# Altium schematic sheet System Control - Bank0.SchDoc
size C
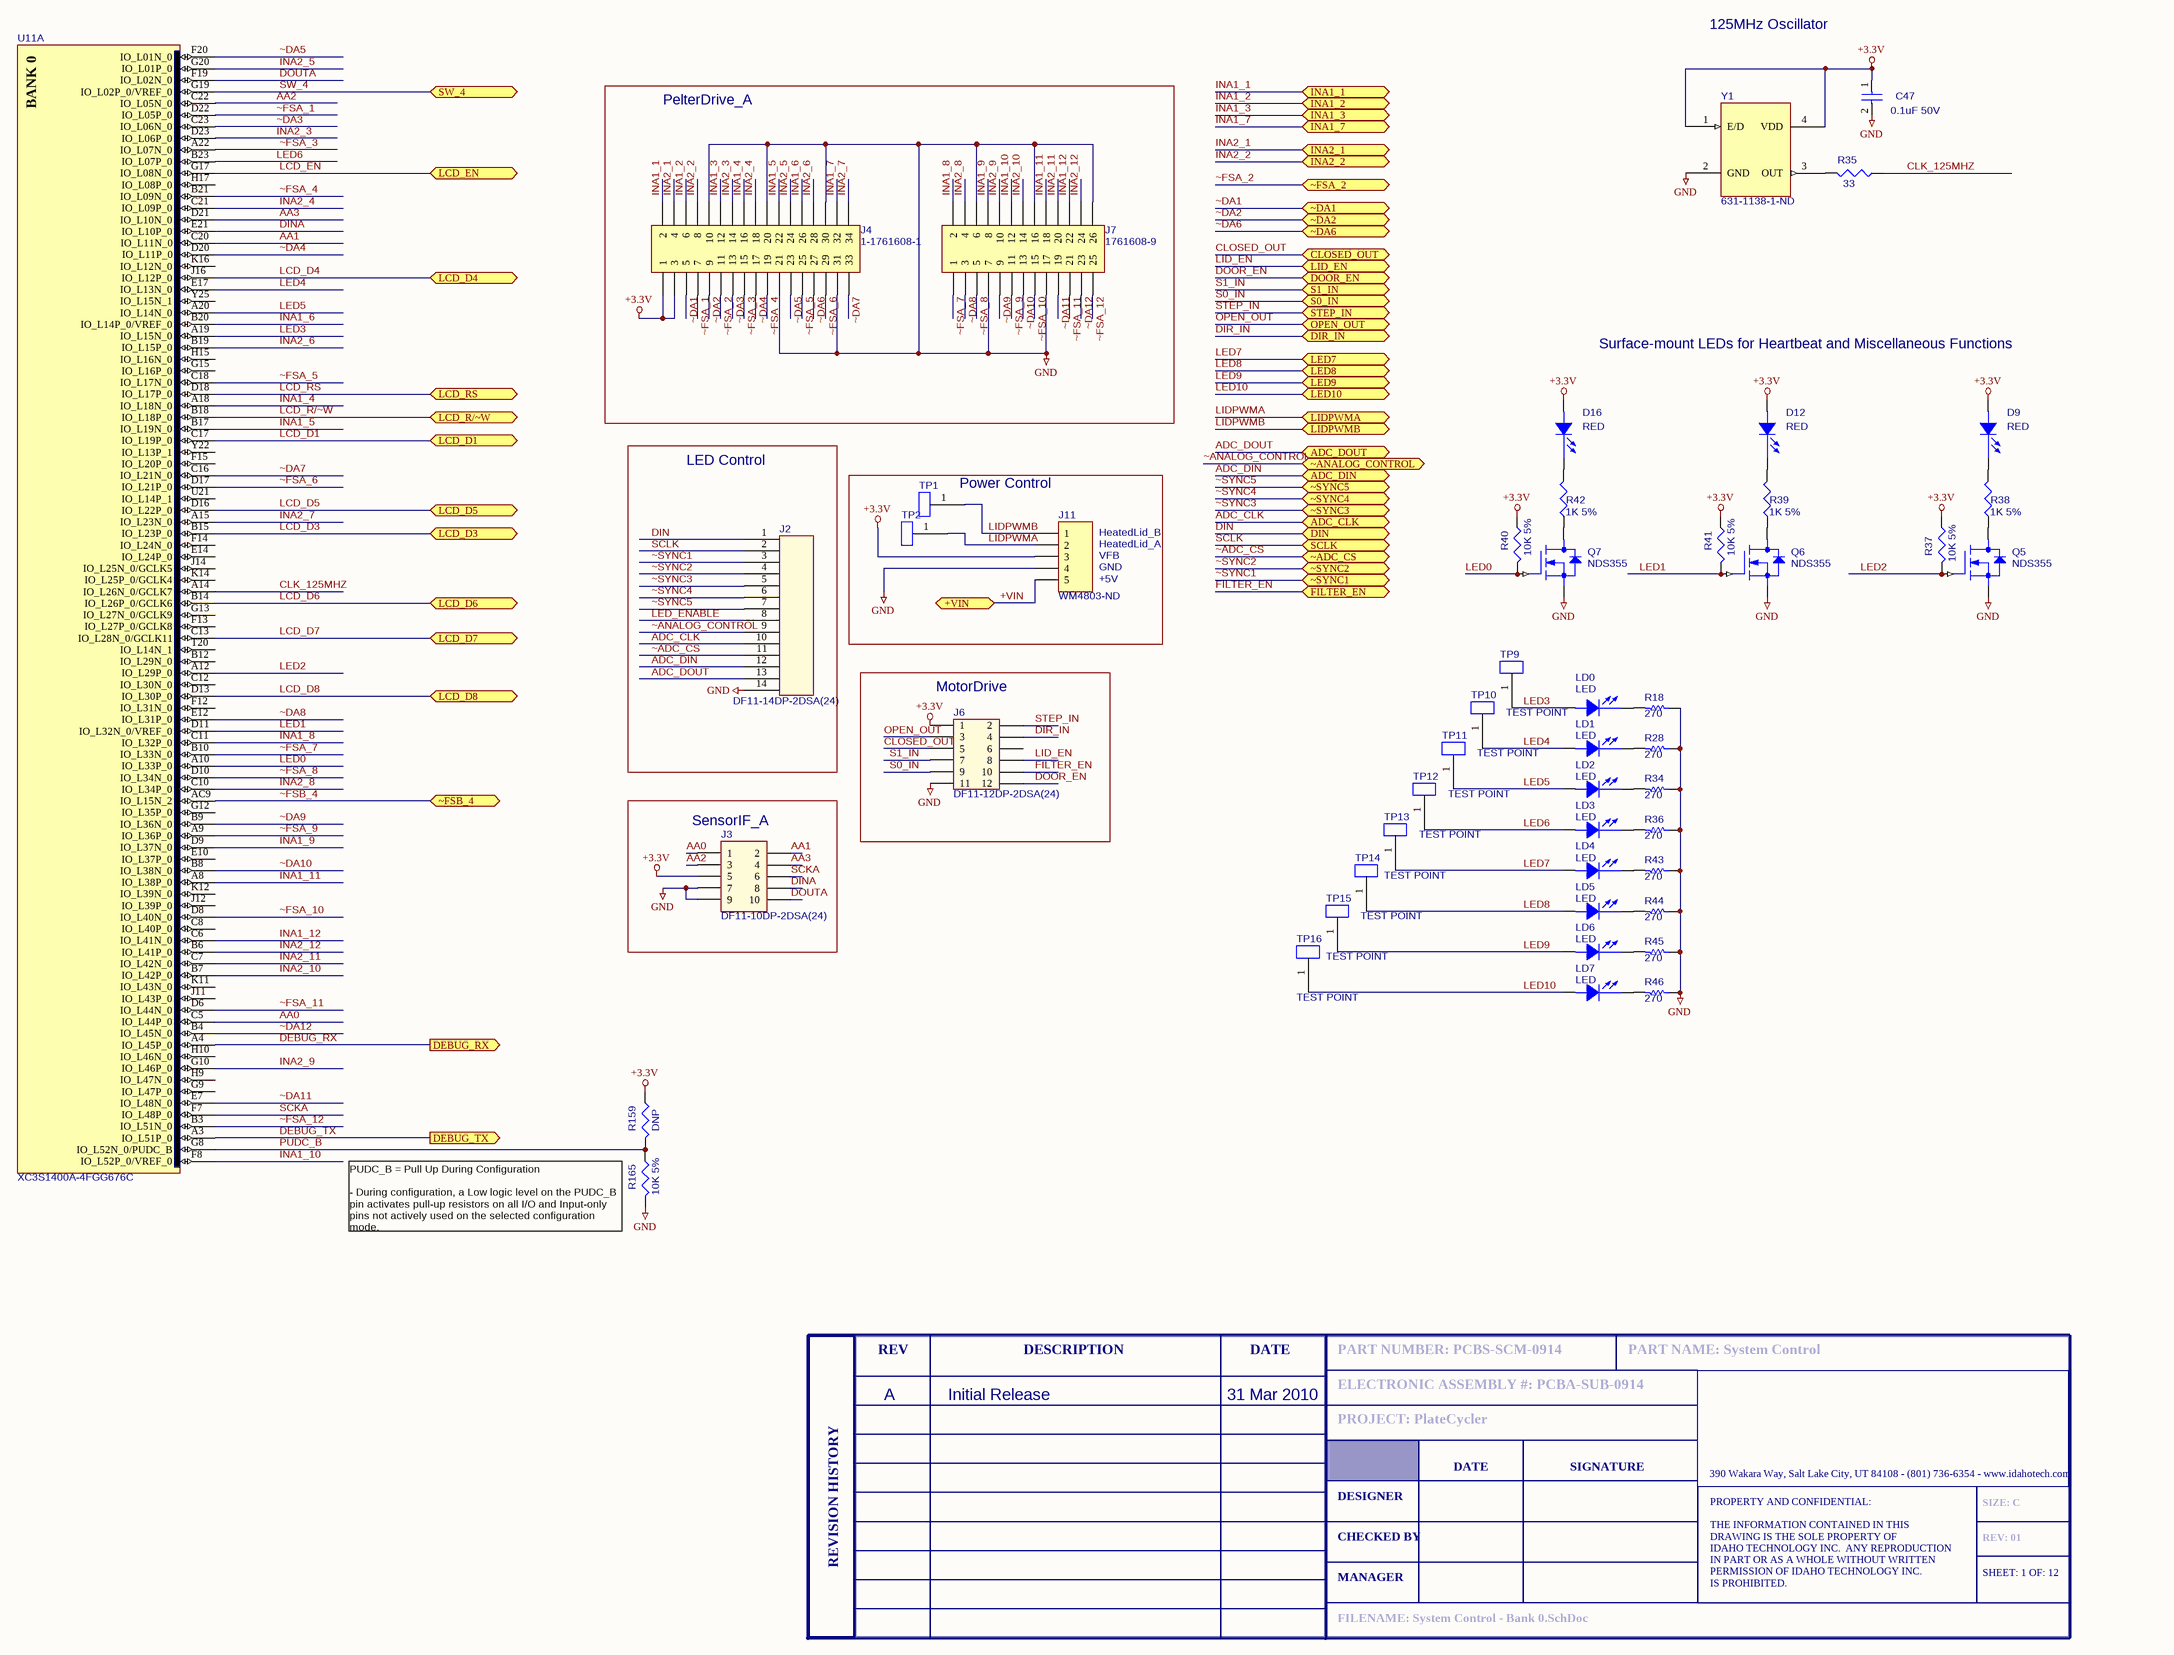
[diagram p0: System Control - Bank0.SchDoc]

## Parts
C47  0.1uF 50V  [SM/C_0603]
D9  RED  [LED 1206]
D12  RED  [LED 1206]
D16  RED  [LED 1206]
J2  Manufacturer P/N: DF11-14DP-2DSA(24)  [HEADER_2X7_1]  (hidden comment: LED Driver)
J3  Manufacturer P/N: DF11-10DP-2DSA(24)  [HEADER_2X5_1]  (hidden comment: Sensor I/F A)
J4  Manufacturer P/N: 1-1761608-1  [HEADER_2X17_2]
J6  Manufacturer P/N: DF11-12DP-2DSA(24)  [HEADER_2X6_1]  (hidden comment: Motor Drive)
J7  Manufacturer P/N: 1761608-9  [HEADER_2X13_2]
J11  Vendor P/N: WM4803-ND  [HDR1X5]  (hidden comment: PWR CONTROL)
LD0  LED  [SM/D_0603]
LD1  LED  [SM/D_0603]
LD2  LED  [SM/D_0603]
LD3  LED  [SM/D_0603]
LD4  LED  [SM/D_0603]
LD5  LED  [SM/D_0603]
LD6  LED  [SM/D_0603]
LD7  LED  [SM/D_0603]
Q5  NDS355  [TO236AA/SOT23]
Q6  NDS355  [TO236AA/SOT23]
Q7  NDS355  [TO236AA/SOT23]
R18  value 270  [0603]  (hidden comment: Res1)
R28  value 270  [0603]  (hidden comment: Res1)
R34  value 270  [0603]  (hidden comment: Res1)
R35  33  [SM/R_0603]
R36  value 270  [0603]  (hidden comment: Res1)
R37  10K 5%  [SM/R_0603]
R38  1K 5%  [SM/R_0603]
R39  1K 5%  [SM/R_0603]
R40  10K 5%  [SM/R_0603]
R41  10K 5%  [SM/R_0603]
R42  1K 5%  [SM/R_0603]
R43  value 270  [0603]  (hidden comment: Res1)
R44  value 270  [0603]  (hidden comment: Res1)
R45  value 270  [0603]  (hidden comment: Res1)
R46  value 270  [0603]  (hidden comment: Res1)
R159  DNP  [SM/R_0603]  (no BOM)
R165  10K 5%  [SM/R_0603]
T?  SIZE: C  REV: 01  FILENAME: System Control - Bank 0.SchDoc  PART NUMBER: PCBS-SCM-0914  PART NAME: System Control  ELECTRONIC ASSEMBLY #: PCBA-SUB-0914  PROJECT: PlateCycler  SHEET: 1  OF: 12  (hidden comment: ITI Title Block)  (graphical)
TP1  LID B PWM  [BLKCON.100/VH/TM1SQ/W.100/1]  (value not drawn)
TP2  LID A PWM  [BLKCON.100/VH/TM1SQ/W.100/1]  (value not drawn)
TP9  TEST POINT  [BLKCON.100/VH/TM1SQ/W.100/1]
TP10  TEST POINT  [BLKCON.100/VH/TM1SQ/W.100/1]
TP11  TEST POINT  [BLKCON.100/VH/TM1SQ/W.100/1]
TP12  TEST POINT  [BLKCON.100/VH/TM1SQ/W.100/1]
TP13  TEST POINT  [BLKCON.100/VH/TM1SQ/W.100/1]
TP14  TEST POINT  [BLKCON.100/VH/TM1SQ/W.100/1]
TP15  TEST POINT  [BLKCON.100/VH/TM1SQ/W.100/1]
TP16  TEST POINT  [BLKCON.100/VH/TM1SQ/W.100/1]
U11  XC3S1400A-4FGG676C  [FGG676]  (part A of 9)
Y1  Vendor P/N: 631-1138-1-ND  [FXO_HC73]  (hidden comment: 125 MHz)

## Blocks framed on the sheet
PelterDrive_A: J4 J7
LED Control: J2
Power Control: J11 TP1 TP2
MotorDrive: J6
SensorIF_A: J3

## Ports
+VIN, ADC_CLK, ADC_DIN, ADC_DOUT, CLOSED_OUT, DEBUG_RX, DEBUG_TX, DIN, DIR_IN, DOOR_EN, FILTER_EN, INA1_1, INA1_2, INA1_3, INA1_7, INA2_1, INA2_2, LCD_D1, LCD_D3, LCD_D4, LCD_D5, LCD_D6, LCD_D7, LCD_D8, LCD_EN, LCD_R/~W, LCD_RS, LED7, LED8, LED9, LED10, LID_EN, LIDPWMA, LIDPWMB, OPEN_OUT, S0_IN, S1_IN, SCLK, STEP_IN, SW_4, ~ADC_CS, ~ANALOG_CONTROL, ~DA1, ~DA2, ~DA6, ~FSA_2, ~FSB_4 (bidir), ~SYNC1, ~SYNC2, ~SYNC3, ~SYNC4, ~SYNC5

## Nets
+3.3V: C47.1 D9.1(ANODE) D12.1(ANODE) D16.1(ANODE) J3.5 J4.1 J4.3 J6.1 J11.3 R37.1 R40.1 R41.1 R159.1 Y1.1(E/D) Y1.4(VDD)
GND: C47.2 J2.14 J3.7 J3.9 J4.10 J4.20 J4.21 J4.30 J4.31 J6.11 J7.6 J7.7 J7.16 J7.17 J7.26 J11.4 Q5.2(SOURCE) Q6.2(SOURCE) Q7.2(SOURCE) R18.1 R28.1 R34.1 R36.1 R43.1 R44.1 R45.1 R46.1 R165.2 Y1.2(GND)
+VIN: J11.5 ; port +VIN
AA0: J3.1 U11.C5(IO_L44P_0)
AA1: J3.2 U11.C20(IO_L11N_0)
AA2: J3.3 U11.C22(IO_L05N_0)
AA3: J3.4 U11.D21(IO_L10N_0)
ADC_CLK: J2.10 ; port ADC_CLK
ADC_DIN: J2.12 ; port ADC_DIN
ADC_DOUT: J2.13 ; port ADC_DOUT
CLK_125MHZ: R35.1 U11.A14(IO_L26N_0/GCLK7)
CLOSED_OUT: J6.5 ; port CLOSED_OUT
DEBUG_RX: U11.A4(IO_L45P_0) ; port DEBUG_RX
DEBUG_TX: U11.A3(IO_L51P_0) ; port DEBUG_TX
DIN: J2.1 ; port DIN
DINA: J3.8 U11.E21(IO_L10P_0)
DIR_IN: J6.4 ; port DIR_IN
DOOR_EN: J6.12 ; port DOOR_EN
DOUTA: J3.10 U11.F19(IO_L02N_0)
FILTER_EN: J6.10 ; port FILTER_EN
INA1_1: J4.2 ; port INA1_1
INA1_2: J4.6 ; port INA1_2
INA1_3: J4.12 ; port INA1_3
INA1_4: J4.16 U11.A18(IO_L18N_0)
INA1_5: J4.22 U11.B17(IO_L19N_0)
INA1_6: J4.26 U11.B20(IO_L14P_0/VREF_0)
INA1_7: J4.32 ; port INA1_7
INA1_8: J7.2 U11.C11(IO_L32P_0)
INA1_9: J7.8 U11.D9(IO_L37N_0)
INA1_10: J7.12 U11.F8(IO_L52P_0/VREF_0)
INA1_11: J7.18 U11.A8(IO_L38P_0)
INA1_12: J7.22 U11.C6(IO_L41N_0)
INA2_1: J4.4 ; port INA2_1
INA2_2: J4.8 ; port INA2_2
INA2_3: J4.14 U11.D23(IO_L06P_0)
INA2_4: J4.18 U11.C21(IO_L09P_0)
INA2_5: J4.24 U11.G20(IO_L01P_0)
INA2_6: J4.28 U11.B19(IO_L15P_0)
INA2_7: J4.34 U11.A15(IO_L23N_0)
INA2_8: J7.4 U11.C10(IO_L34P_0)
INA2_9: J7.10 U11.G10(IO_L46P_0)
INA2_10: J7.14 U11.B7(IO_L42P_0)
INA2_11: J7.20 U11.C7(IO_L42N_0)
INA2_12: J7.24 U11.B6(IO_L41P_0)
LCD_D1: U11.C17(IO_L19P_0) ; port LCD_D1
LCD_D3: U11.B15(IO_L23P_0) ; port LCD_D3
LCD_D4: U11.J16(IO_L12P_0) ; port LCD_D4
LCD_D5: U11.D16(IO_L22P_0) ; port LCD_D5
LCD_D6: U11.B14(IO_L26P_0/GCLK6) ; port LCD_D6
LCD_D7: U11.C13(IO_L28N_0/GCLK11) ; port LCD_D7
LCD_D8: U11.D13(IO_L30P_0) ; port LCD_D8
LCD_EN: U11.G17(IO_L08N_0) ; port LCD_EN
LCD_R/~W: U11.B18(IO_L18P_0) ; port LCD_R/~W
LCD_RS: U11.D18(IO_L17P_0) ; port LCD_RS
LED0: Q7.1(GATE) R40.2 U11.A10(IO_L33P_0)
LED1: Q6.1(GATE) R41.2 U11.D11(IO_L32N_0/VREF_0)
LED2: Q5.1(GATE) R37.2 U11.A12(IO_L29P_0)
LED3: LD0.1(ANODE) TP9.1 U11.A19(IO_L15N_0)
LED4: LD1.1(ANODE) TP10.1 U11.E17(IO_L13N_0)
LED5: LD2.1(ANODE) TP11.1 U11.A20(IO_L14N_0)
LED6: LD3.1(ANODE) TP12.1 U11.B23(IO_L07P_0)
LED7: LD4.1(ANODE) TP13.1 ; port LED7
LED8: LD5.1(ANODE) TP14.1 ; port LED8
LED9: LD6.1(ANODE) TP15.1 ; port LED9
LED10: LD7.1(ANODE) TP16.1 ; port LED10
LED_ENABLE: J2.8
LID_EN: J6.8 ; port LID_EN
LIDPWMA: J11.2 TP2.1 ; port LIDPWMA
LIDPWMB: J11.1 TP1.1 ; port LIDPWMB
OPEN_OUT: J6.3 ; port OPEN_OUT
PUDC_B: R159.2 R165.1 U11.G8(IO_L52N_0/PUDC_B)
S0_IN: J6.9 ; port S0_IN
S1_IN: J6.7 ; port S1_IN
SCKA: J3.6 U11.F7(IO_L48P_0)
SCLK: J2.2 ; port SCLK
STEP_IN: J6.2 ; port STEP_IN
SW_4: U11.G19(IO_L02P_0/VREF_0) ; port SW_4
~ADC_CS: J2.11 ; port ~ADC_CS
~ANALOG_CONTROL: J2.9 ; port ~ANALOG_CONTROL
~DA1: J4.5 ; port ~DA1
~DA2: J4.9 ; port ~DA2
~DA3: J4.13 U11.C23(IO_L06N_0)
~DA4: J4.17 U11.D20(IO_L11P_0)
~DA5: J4.23 U11.F20(IO_L01N_0)
~DA6: J4.27 ; port ~DA6
~DA7: J4.33 U11.C16(IO_L21N_0)
~DA8: J7.3 U11.E12(IO_L31P_0)
~DA9: J7.9 U11.B9(IO_L36N_0)
~DA10: J7.13 U11.B8(IO_L38N_0)
~DA11: J7.19 U11.E7(IO_L48N_0)
~DA12: J7.23 U11.B4(IO_L45N_0)
~FSA_1: J4.7 U11.D22(IO_L05P_0)
~FSA_2: J4.11 ; port ~FSA_2
~FSA_3: J4.15 U11.A22(IO_L07N_0)
~FSA_4: J4.19 U11.B21(IO_L09N_0)
~FSA_5: J4.25 U11.C18(IO_L17N_0)
~FSA_6: J4.29 U11.D17(IO_L21P_0)
~FSA_7: J7.1 U11.B10(IO_L33N_0)
~FSA_8: J7.5 U11.D10(IO_L34N_0)
~FSA_9: J7.11 U11.A9(IO_L36P_0)
~FSA_10: J7.15 U11.D8(IO_L40N_0)
~FSA_11: J7.21 U11.D6(IO_L44N_0)
~FSA_12: J7.25 U11.B3(IO_L51N_0)
~FSB_4: U11.AC9(IO_L15N_2) ; port ~FSB_4
~SYNC1: J2.3 ; port ~SYNC1
~SYNC2: J2.4 ; port ~SYNC2
~SYNC3: J2.5 ; port ~SYNC3
~SYNC4: J2.6 ; port ~SYNC4
~SYNC5: J2.7 ; port ~SYNC5
NetD9_2: D9.2(CATHODE) R38.2
NetD12_2: D12.2(CATHODE) R39.2
NetD16_2: D16.2(CATHODE) R42.2
NetLD0_2: LD0.2(CATHODE) R18.2
NetLD1_2: LD1.2(CATHODE) R28.2
NetLD2_2: LD2.2(CATHODE) R34.2
NetLD3_2: LD3.2(CATHODE) R36.2
NetLD4_2: LD4.2(CATHODE) R43.2
NetLD5_2: LD5.2(CATHODE) R44.2
NetLD6_2: LD6.2(CATHODE) R45.2
NetLD7_2: LD7.2(CATHODE) R46.2
NetQ5_3: Q5.3(DRAIN) R38.1
NetQ6_3: Q6.3(DRAIN) R39.1
NetQ7_3: Q7.3(DRAIN) R42.1
NetR35_2: R35.2 Y1.3(OUT)

Not connected (* = marked no-connect by the designer): J6 6; U11 B12(IO_L29N_0) C8(IO_L40P_0) C12(IO_L30N_0) E10(IO_L37P_0) E14(IO_L24P_0) F12(IO_L31N_0) F13(IO_L27P_0/GCLK8) F14(IO_L24N_0) F15(IO_L20P_0) G9(IO_L47P_0) G12(IO_L35P_0) G13(IO_L27N_0/GCLK9) G15(IO_L16P_0) H9(IO_L47N_0) H10(IO_L46N_0) H15(IO_L16N_0) H17(IO_L08P_0) J11(IO_L43P_0) J12(IO_L39P_0) J14(IO_L25N_0/GCLK5) K11(IO_L43N_0) K12(IO_L39N_0) K14(IO_L25P_0/GCLK4) K16(IO_L12N_0) T20(IO_L14N_1) U21(IO_L14P_1) Y22(IO_L13P_1) Y25(IO_L15N_1)

## Notes on the sheet
- 125MHz Oscillator
- Surface-mount LEDs for Heartbeat and Miscellaneous Functions
- (near J11) HeatedLid_B
- (near J11) HeatedLid_A
- (near J11) VFB
- (near J11) GND
- (near J11) +5V
- PUDC_B = Pull Up During Configuration
  - During configuration, a Low logic level on the PUDC_B pin activates pull-up resistors on all I/O and Input-only pins not actively used on the selected configuration mode.
- A
- Initial Release
- 31 Mar 2010
- (in symbol ITI TITLE BLOCK AND REVISION TABLE) REV; DESCRIPTION; DATE; SIGNATURE; 390 Wakara Way, Salt Lake City, UT 84108 - (801) 736-6354 - www.idahotech.com; DESIGNER; CHECKED BY; REVISION HISTORY; MANAGER; PROPERTY AND CONFIDENTIAL: / THE INFORMATION CONTAINED IN THIS / DRAWING IS THE SOLE PROPERTY OF / IDAHO TECHNOLOGY INC.  ANY REPRODUCTION / IN PART OR AS A WHOLE WITHOUT WRITTEN / PERMISSION OF IDAHO TECHNOLOGY INC. / IS PROHIBITED.
- (in symbol XC3S1400A-4FGG676C, part A) BANK 0

## Library data of the parts
C47 = CAP NP_1: CAP CER .10UF 50V X7R 0603; Manufacturer P/N: UMK107B7104KA-T; Manufacturer: Taiyo Yuden; Vendor P/N: 587-1243-1-ND; Vendor: Digikey
D9 D12 D16 = LED: LED 635NM RED WTR CLR 1206 SMD; Manufacturer: Lumex; Manufacturer P/N: SML-LX1206IC-TR; Vendor: Digikey; Vendor P/N: 67-1356-1-ND
J2 = 14 pin Hirose: CONN HEADER 14POS 2MM PCB TIN; Manufacturer: Hirose; Vendor: Digikey; Vendor P/N: H10234-ND
J3 = HEADER_2X5_1: CONN HEADER 10POS 2MM PCB TIN; Manufacturer: HIROSE; Vendor: DIGIKEY; Vendor P/N: H10232-ND; Price: 0.65
J4 = Header 17X2: CONN HEADER LOPRO STR .100 34POS; Manufacturer: Tyco; Vendor: Digikey; Vendor P/N: A31188-ND
J6 = HEADER_2X6_1: CONN HEADER 12POS 2MM PCB TIN; Manufacturer: HIROSE; Vendor: DIGIKEY; Vendor P/N: H10233-ND; Price: 0.72
J7 = Header 13X2: CONN HEADER LOPRO STR .100 26POS; Manufacturer: Tyco; Vendor: Digikey; Vendor P/N: A31187-ND; Price: 5.26
J11 = Header 5: CONN HEADER 5POS .100 VERT GOLD; Manufacturer: Molex; Manufacturer P/N: 70543-0004; Vendor: Digikey; Desc: CONN HEADER 5POS .100 VERT GOLD; Price: 1.41
LD0-LD7 = LED: LED 565NM GRN DIFF 0603 SMD; Manufacturer: Lumex Opto/Components Inc; Manufacturer P/N: SML-LX0603GW-TR; Vendor: Digikey; Vendor P/N: 67-1549-1-ND
Q5-Q7 = NDS355N/SOT: MOSFET N-CH 30V 1.6A SOT-23; Manufacturer: Fairchild Semiconductor; Vendor: Digikey; Vendor P/N: NDS355NCT-ND; Manufacturer P/N: NDS355N
R18 R28 R34 R36 R43-R46 = Res1: RES 270 OHM 1/10W 5% 0603 SMD; Manufacturer: Panasonic; Manufacturer P/N: ERJ-3GEYJ271V; Vendor: DIGIKEY; Vendor P/N: P270GCT-ND; IT P/N: N/A; Price: 0.71
R35 = R10K 5% 0603: RES 33 OHM 1/10W 5% 0603 SMD; Manufacturer: Panasonic; Manufacturer P/N: ERJ-3GEYJ330V; Vendor: Digikey; Vendor P/N: P33GCT-ND
R37 R40 R41 R159 R165 = R10K 5% 0603: RES 10K OHM 1/10W 5% 0603 SMD; Manufacturer: Panasonic; Manufacturer P/N: ERJ-3GEYJ103V; Vendor: Digikey; Vendor P/N: P10KGCT-ND
R38 R39 R42 = R1K 5% 0603: RES 1.0K OHM 1/10W 5% 0603 SMD; Manufacturer: Panasonic; Manufacturer P/N: ERJ-3GEYJ102V; Vendor: Digikey; Vendor P/N: P1.0KGCT-ND
T? = ITI TITLE BLOCK AND REVISION TABLE
TP1 TP2 TP9-TP16 = TEST POINT: TEST POINT PC MINI .040"D RED; Manufacturer P/N: 5000; Manufacturer: Keystone Electronics; Vendor P/N: 5000K-ND; Vendor: Digikey
U11 = XC3S1400A-4FGG676C: IC, SPARTAN-3A, FPGA, 1400K, 656FBGA; Manufacturer: Xilinx Inc; Vendor: Digikey; Vendor P/N: 122-1551-ND; Published: 12-Dec-2006; DatasheetVersion: 08-May-2007; PackageVersion: ver1.2.1, Apr-2005; PackageReference: FGG676; Publisher: Altium Limited; PackageDescription: 676-Ball Fine Pitch Ball Grid Array (FGG676) - Pb-Free; Code_JEDEC: MS-034-AAL-1; Code_IPC: BGA100P26X26-676; ComponentLink1Description: Manufacturer Link; ComponentLink1URL: http://www.xilinx.com/products/silicon_solutions/fpgas/spartan_series/spartan3a_fpgas/index.htm; ComponentLink2Description: Datasheet; ComponentLink2URL: http://direct.xilinx.com/bvdocs/publications/ds529.pdf; Desc: IC, SPARTAN-3A, FPGA, 1400K, 656FBGA; Manufacturer P/N: XC3S1400A-4FGG676C
Y1 = FXO-HC73: OSC 125.0000 MHZ 3.3V HCMOS SMT; Manufacturer P/N: FXO-HC735-125MHZ; Manufacturer: FOX Electronics; Vendor: Digikey